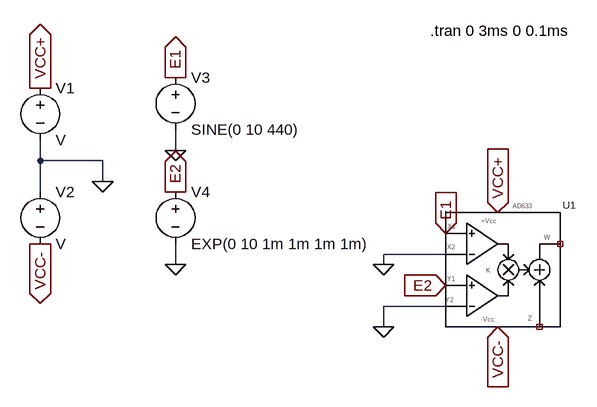
[diagram p0: schematic Draft1.asc]
Draft1.asc, the LTspice schematic file:
Version 4
SHEET 1 880 680
WIRE -224 0 -224 -32
WIRE -432 16 -432 -16
WIRE -336 16 -432 16
WIRE -336 48 -336 16
WIRE -432 64 -432 16
WIRE 192 160 96 160
WIRE -224 176 -224 144
WIRE 96 176 96 160
WIRE 192 240 96 240
WIRE 96 272 96 240
FLAG -336 48 0
FLAG -224 0 0
FLAG -224 176 0
FLAG -432 -96 VCC+
IOPIN -432 -96 Out
FLAG -432 144 VCC-
IOPIN -432 144 Out
FLAG -224 -112 E1
IOPIN -224 -112 Out
FLAG -224 64 E2
IOPIN -224 64 Out
FLAG 272 96 VCC+
IOPIN 272 96 In
FLAG 272 272 VCC-
IOPIN 272 272 In
FLAG 192 128 E1
IOPIN 192 128 In
FLAG 192 208 E2
IOPIN 192 208 In
FLAG 96 176 0
FLAG 96 272 0
SYMBOL AD633 288 176 R0
SYMATTR InstName U1
SYMBOL voltage -432 -112 R0
SYMATTR InstName V1
SYMBOL voltage -432 48 R0
SYMATTR InstName V2
SYMBOL voltage -224 -128 R0
WINDOW 123 0 0 Left 0
WINDOW 39 0 0 Left 0
SYMATTR InstName V3
SYMATTR Value SINE(0 10 440)
SYMBOL voltage -224 48 R0
WINDOW 123 0 0 Left 0
WINDOW 39 0 0 Left 0
SYMATTR InstName V4
SYMATTR Value EXP(0 10 1m 1m 1m 1m)
TEXT 168 -184 Left 2 !.tran 0 3ms 0 0.1ms

The netlist it stands for:
* Draft1.asc
XU1 E1 0 E2 0 VCC- NC_01 NC_02 VCC+ ad633
V1 VCC+ 0 V
V2 0 VCC- V
V3 E1 0 SINE(0 10 440)
V4 E2 0 EXP(0 10 1m 1m 1m 1m)
.tran 0 3ms 0 0.1ms
.backanno
.end